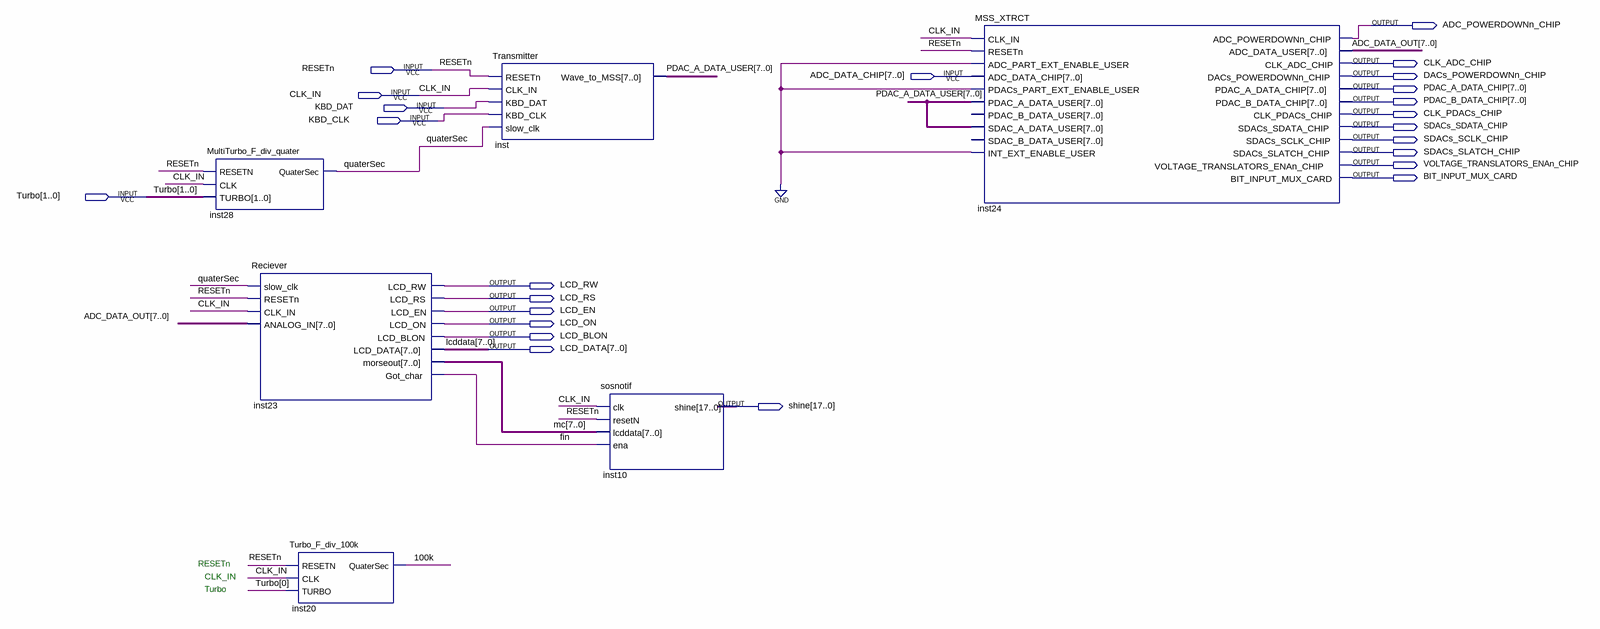
[diagram p0: schematic sheet]
// Quartus schematic COMPLETE_PROJECT.bdf as structural Verilog: 6 symbols, 24 pins
module COMPLETE_PROJECT (
  input  RESETn,
  input  [7:0] ADC_DATA_CHIP,
  input  CLK_IN,
  input  KBD_DAT,
  input  KBD_CLK,
  input  [1:0] Turbo,
  output ADC_POWERDOWNn_CHIP,
  output CLK_ADC_CHIP,
  output DACs_POWERDOWNn_CHIP,
  output [7:0] PDAC_A_DATA_CHIP,
  output [7:0] PDAC_B_DATA_CHIP,
  output CLK_PDACs_CHIP,
  output SDACs_SDATA_CHIP,
  output SDACs_SCLK_CHIP,
  output SDACs_SLATCH_CHIP,
  output VOLTAGE_TRANSLATORS_ENAn_CHIP,
  output BIT_INPUT_MUX_CARD,
  output LCD_RW,
  output LCD_RS,
  output LCD_EN,
  output LCD_ON,
  output LCD_BLON,
  output [7:0] LCD_DATA,
  output [17:0] shine
);

  wire \100k , fin, quaterSec;
  wire [7:0] ADC_DATA_OUT, mc, PDAC_A_DATA_USER;

  MultiTurbo_F_div_quater inst28 (.RESETN(RESETn), .CLK(CLK_IN), .TURBO(Turbo), .QuaterSec(quaterSec));
  Reciever inst23 (
    .slow_clk(quaterSec), .RESETn(RESETn), .CLK_IN(CLK_IN), .ANALOG_IN(ADC_DATA_OUT), .LCD_RW(LCD_RW),
    .LCD_RS(LCD_RS), .LCD_EN(LCD_EN), .LCD_ON(LCD_ON), .LCD_BLON(LCD_BLON), .LCD_DATA(LCD_DATA),
    .morseout(mc), .Got_char(fin));
  Turbo_F_div_100k inst20 (.RESETN(RESETn), .CLK(CLK_IN), .TURBO(Turbo[0]), .QuaterSec(\100k ));
  Transmitter inst (
    .RESETn(RESETn), .CLK_IN(CLK_IN), .KBD_DAT(KBD_DAT), .KBD_CLK(KBD_CLK), .slow_clk(quaterSec),
    .Wave_to_MSS(PDAC_A_DATA_USER));
  sosnotif inst10 (.clk(CLK_IN), .resetN(RESETn), .lcddata(mc), .ena(fin), .shine(shine));
  MSS_XTRCT inst24 (
    .CLK_IN(CLK_IN), .RESETn(RESETn), .ADC_PART_EXT_ENABLE_USER(1'b0), .ADC_DATA_CHIP(ADC_DATA_CHIP),
    .PDACs_PART_EXT_ENABLE_USER(1'b0), .PDAC_A_DATA_USER(PDAC_A_DATA_USER),
    .SDAC_A_DATA_USER(PDAC_A_DATA_USER), .INT_EXT_ENABLE_USER(1'b0),
    .ADC_POWERDOWNn_CHIP(ADC_POWERDOWNn_CHIP), .ADC_DATA_USER(ADC_DATA_OUT), .CLK_ADC_CHIP(CLK_ADC_CHIP),
    .DACs_POWERDOWNn_CHIP(DACs_POWERDOWNn_CHIP), .PDAC_A_DATA_CHIP(PDAC_A_DATA_CHIP),
    .PDAC_B_DATA_CHIP(PDAC_B_DATA_CHIP), .CLK_PDACs_CHIP(CLK_PDACs_CHIP),
    .SDACs_SDATA_CHIP(SDACs_SDATA_CHIP), .SDACs_SCLK_CHIP(SDACs_SCLK_CHIP),
    .SDACs_SLATCH_CHIP(SDACs_SLATCH_CHIP), .VOLTAGE_TRANSLATORS_ENAn_CHIP(VOLTAGE_TRANSLATORS_ENAn_CHIP),
    .BIT_INPUT_MUX_CARD(BIT_INPUT_MUX_CARD));  // open: PDAC_B_DATA_USER, SDAC_B_DATA_USER

  // Other names for the same wires on the sheet: lcddata[7:0] = LCD_DATA

  // Notes on the sheet:
  //   RESETn
  //   CLK_IN
  //   Turbo
endmodule
